# Altium schematic sheet MachineLearning-MM-Carrier.SchDoc: MachineLearning-MM-Carrier
size 459 x 320 mm; Origin: Eagle; Date: 5/7/2021 12:24:21 AM; SheetNumber: 1; DESIGNER: DESIGNER; REV: REV; GateName_1: G$1; SymbolName_1: FRAME_LEDGER; LibraryName: SparkFun-Aesthetics; DeviceSetName: FRAME-LEDGER; GateName_2: G$2; SymbolName_2: DOCFIELD; Sheet: Sheet:; ReleasedundertheCreativeCommons: Released under the Creative Commons; AttributionShare-Alike4.0License: Attribution Share-Alike 4.0 License; https://creativecommons.org/licenses/by-sa/4.0/: https://creativecommons.org/licenses/by-sa/4.0/; Designby: Design by:
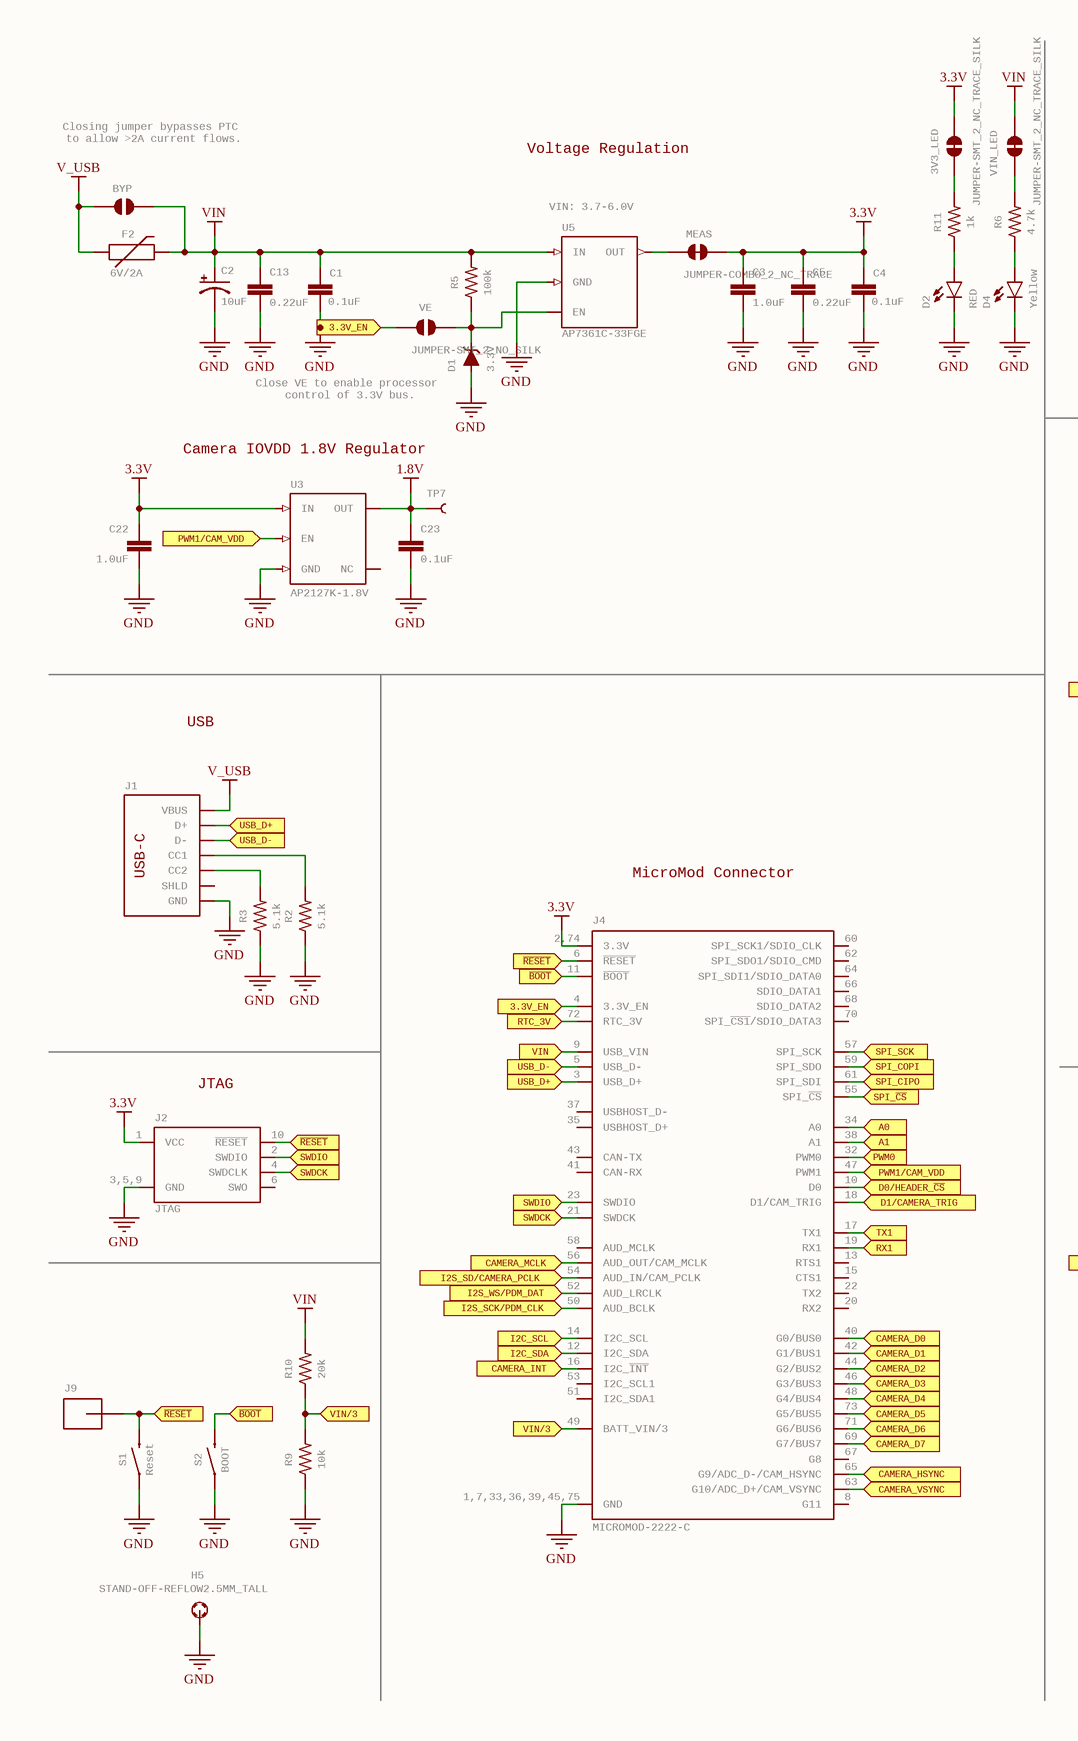
[diagram p0: MachineLearning-MM-Carrier.SchDoc, left]
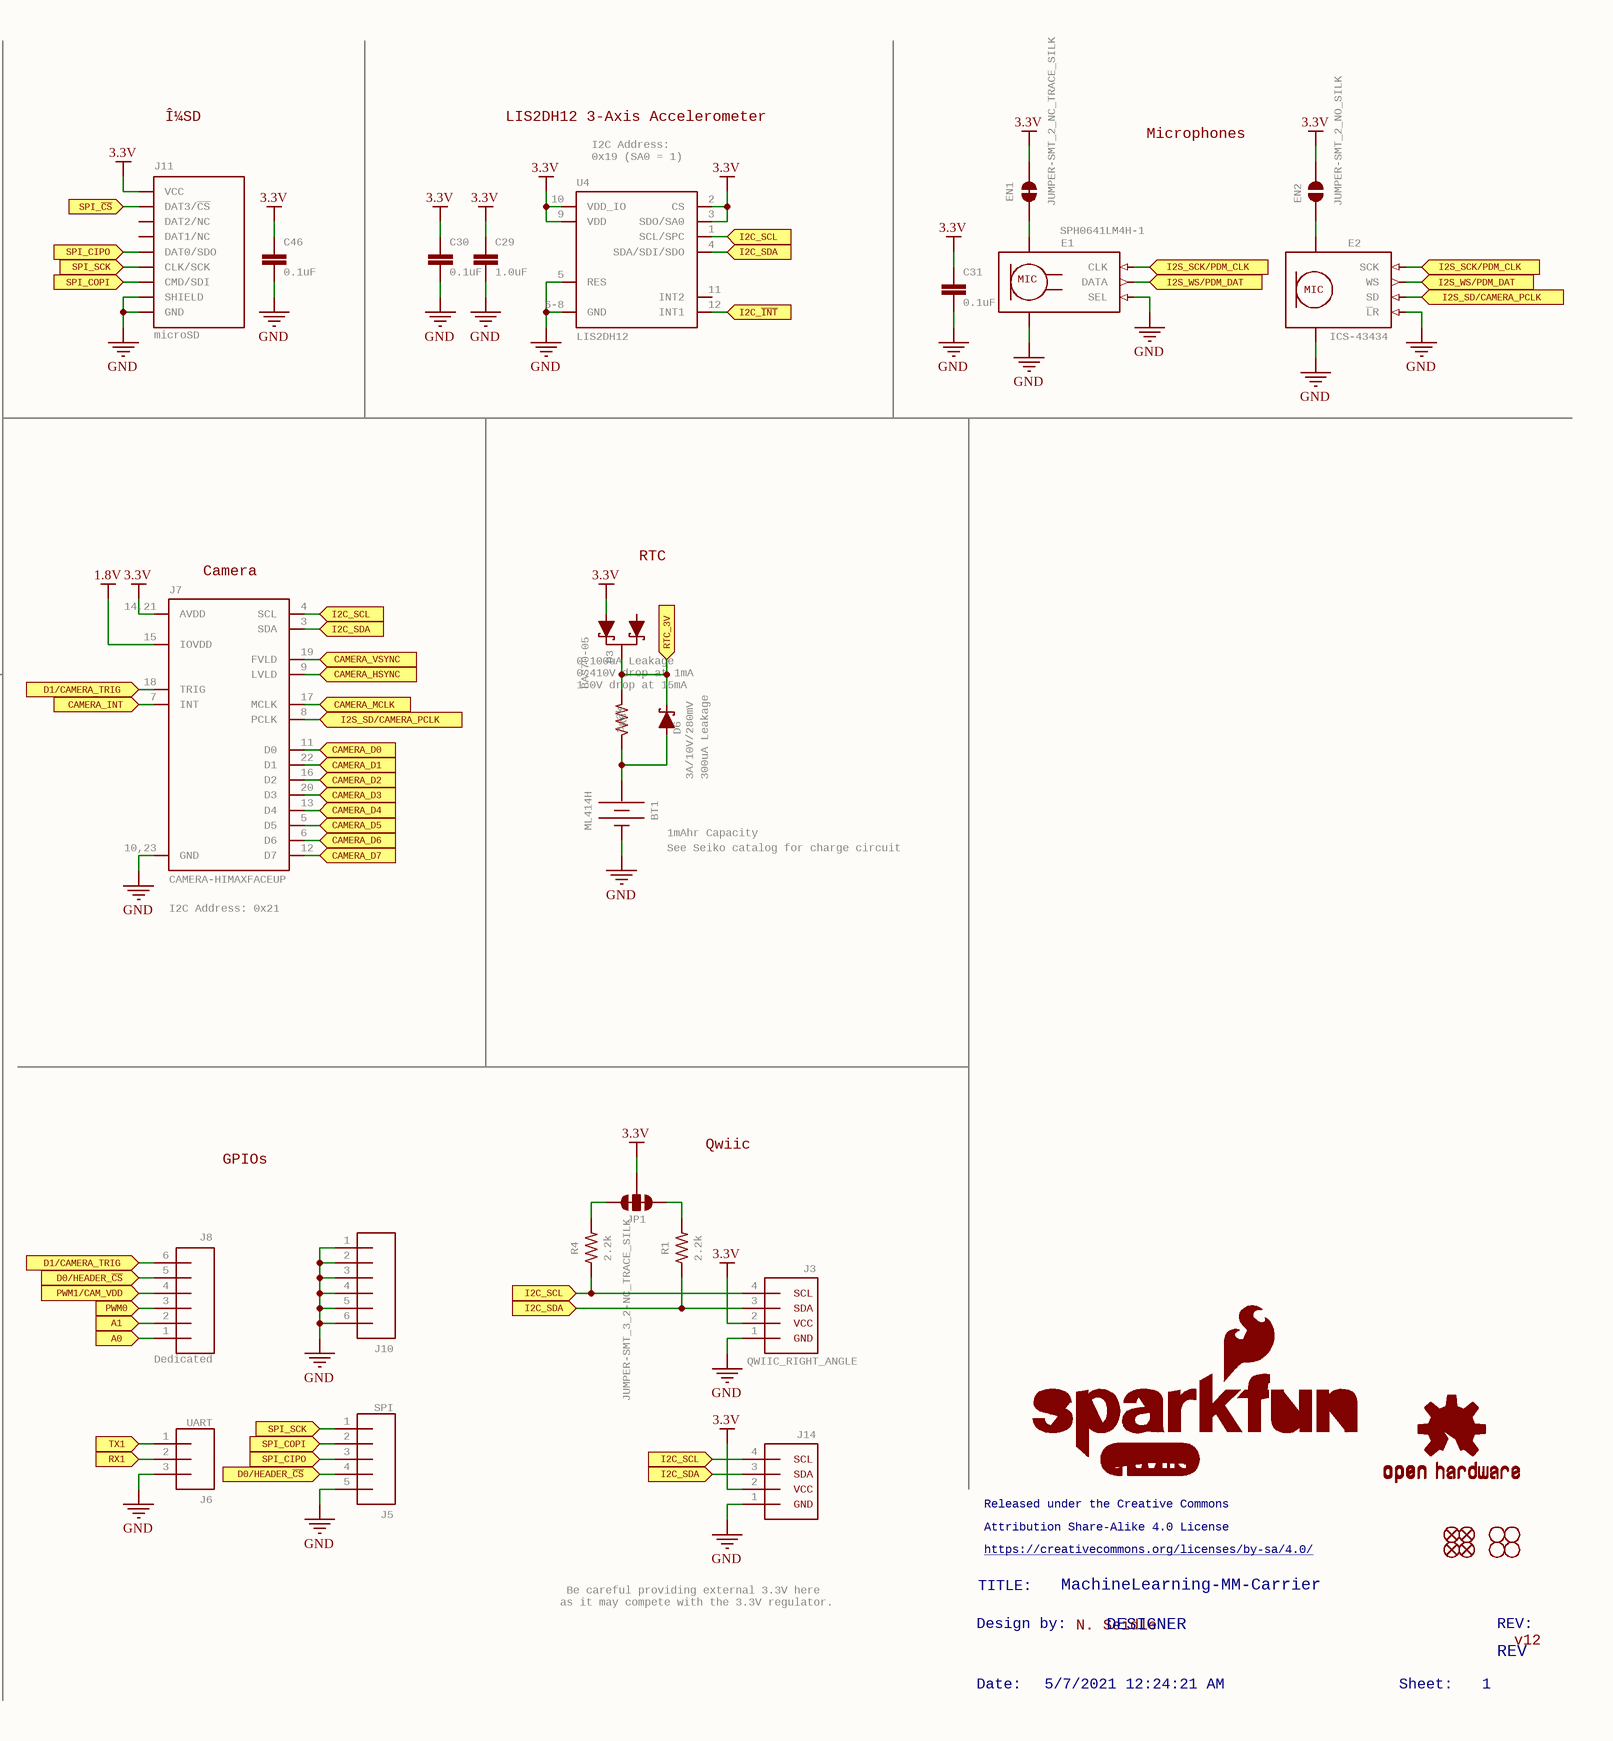
[diagram p1: MachineLearning-MM-Carrier.SchDoc, right]

## Parts
3V3_LED  JUMPER-SMT_2_NC_TRACE_SILK  [SMT-JUMPER_2_NC_TRACE_SILK]
BT1  ML414H  [ML414H_IV01E]
BYP  JUMPER-SMT_2_NO_SILK  [SMT-JUMPER_2_NO_SILK]  (value not drawn)
C1  0.1uF  [0603]
C2  10uF  [EIA3216]
C3  1.0uF  [0603]
C4  0.1uF  [0603]
C5  0.22uF  [0603]
C13  0.22uF  [0603]
C22  1.0uF  [0603]
C23  0.1uF  [0603]
C29  1.0uF  [0603]
C30  0.1uF  [0603]
C31  0.1uF  [0603]
C46  0.1uF  [0603]
D1  3.3V  [SOD-323]
D2  RED  [LED-0603]
D3  BAS70-05  [SOT23-3]
D4  Yellow  [LED-0603]
D6  3A/10V/280mV  [SOD-323]
E1  SPH0641LM4H-1  [SPH0641LM4H-1_MICROPHONE]
E2  ICS-43434  [ICS-43434]
EN1  JUMPER-SMT_2_NC_TRACE_SILK  [SMT-JUMPER_2_NC_TRACE_SILK]
EN2  JUMPER-SMT_2_NO_SILK  [SMT-JUMPER_2_NO_SILK]
F2  6V/2A  [1210]
FD1  FIDUCIALUFIDUCIAL  [FIDUCIAL-MICRO]  (value not drawn)
FD2  FIDUCIALUFIDUCIAL  [FIDUCIAL-MICRO]  (value not drawn)
FD3  FIDUCIALUFIDUCIAL  [FIDUCIAL-MICRO]  (value not drawn)
FD4  FIDUCIALUFIDUCIAL  [FIDUCIAL-MICRO]  (value not drawn)
H1  STAND-OFF  [STAND-OFF]  (value not drawn)
H2  STAND-OFF  [STAND-OFF]  (value not drawn)
H3  STAND-OFF  [STAND-OFF]  (value not drawn)
H4  STAND-OFF  [STAND-OFF]  (value not drawn)
H5  STAND-OFF-REFLOW2.5MM_TALL  [STAND-OFF-REFLOW-M2.5]
J1  USB_C_2-LAYER_PADS  [USB-C-16P-2LAYER-PADS]  (value not drawn)
J2  JTAG  [2X5-PTH-1.27MM]
J3  QWIIC_RIGHT_ANGLE  [JST04_1MM_RA]
J4  MICROMOD-2222-C  [M.2-CONNECTOR-E]
J5  SPI  [1X05_NO_SILK]
J6  UART  [1X03_NO_SILK]
J7  CAMERA-HIMAXFACEUP  [FPC05024-42201]
J8  Dedicated  [1X06_NO_SILK]
J9  CONN_01PTH_NO_SILK_YES_STOP  [1X01_NO_SILK]  (value not drawn)
J10  CONN_06NO_SILK_NO_POP  [1X06_NO_SILK]  (value not drawn)
J11  microSD  [MICRO-SD-SOCKET]
J14  I2C_STANDARD_NO_SILK  [1X04_NO_SILK]  (value not drawn)
JP1  JUMPER-SMT_3_2-NC_TRACE_SILK  [SMT-JUMPER_3_2-NC_TRACE_SILK]
LOGO1  SFE_LOGO_NAME_FLAME.1_INCH  [SFE_LOGO_NAME_FLAME_.1]  (value not drawn)
LOGO2  QWIIC_LOGO_CONNECTOR  [QWIIC_5.5MM]  (value not drawn)
LOGO3  OSHW-LOGOMINI  [OSHW-LOGO-MINI]  (value not drawn)
MEAS  JUMPER-COMBO_2_NC_TRACE  [COMBO-JUMPER_2_NC_TRACE]
R1  2.2k  [0603]
R2  5.1k  [0603]
R3  5.1k  [0603]
R4  2.2k  [0603]
R5  100k  [0603]
R6  4.7k  [0603]
R8  3.3k  [0603]
R9  10k  [0603]
R10  20k  [0603]
R11  1k  [0603]
S1  Reset  [TACTILE_SWITCH_SMD_5.2MM]
S2  BOOT  [TACTILE_SWITCH_SMD_5.2MM]
TP7  TEST-POINT3X5  [PAD.03X.05]  (value not drawn)
U3  AP2127K-1.8V  [SOT23-5]
U4  LIS2DH12  [LGA-12-LISDH12]
U5  AP7361C-33FGE  [UDFN-8]
VE  JUMPER-SMT_2_NO_SILK  [SMT-JUMPER_2_NO_SILK]
VIN_LED  JUMPER-SMT_2_NC_TRACE_SILK  [SMT-JUMPER_2_NC_TRACE_SILK]

## Ports
3.3V_EN (in), A0 (in), A1 (in), CAMERA_D0 (in), CAMERA_D1 (in), CAMERA_D2 (in), CAMERA_D3 (in), CAMERA_D4 (in), CAMERA_D5 (in), CAMERA_D6 (in), CAMERA_D7 (in), CAMERA_HSYNC (in), CAMERA_INT (in), CAMERA_MCLK (in), CAMERA_VSYNC (in), D0/HEADER_~{CS} (in), D1/CAMERA_TRIG (in), I2C_SCL (in), I2C_SDA (in), I2C_~{INT} (in), I2S_SCK/PDM_CLK (in), I2S_SD/CAMERA_PCLK (in), I2S_WS/PDM_DAT (in), PWM0 (in), PWM1/CAM_VDD (in), RTC_3V (in), RX1 (in), SPI_CIPO (in), SPI_COPI (in), SPI_SCK (in), SPI_~{CS} (in), SWDCK (in), SWDIO (in), TX1 (in), USB_D+ (in), USB_D- (in), VIN (in), VIN/3 (in), ~{BOOT} (in), ~{RESET} (in)

## Nets
1.8V: C23.1 J7.15(IOVDD) TP7.P$1 U3.5(OUT)
3.3V: 3V3_LED.2 C3.1 C4.1 C5.1 C22.1 C29.1 C30.1 C31.1 C46.1 D3.2(A1) EN1.2 EN2.2 J2.1(VCC) J3.2 J4.2,74(3.3V) J7.14,21(AVDD) J11.VCC J14.2 JP1.2 MEAS.2,4 U3.1(IN) U4.2(CS) U4.3(SDO/SA0) U4.9(VDD) U4.10(VDD_IO)
GND: BT1.- C1.2 C2.- C3.2 C4.2 C5.2 C13.2 C22.2 C23.2 C29.2 C30.2 C31.2 C46.2 D1.A D2.C D4.C E1.2(SEL) E1.3,6,7,8(GND) E2.2(~{L}R) E2.3,7,8,9(GND) H5.1 J1.GND,GND2(GND) J2.3,5,9(GND) J3.1 J4.1,7,33,36,39,45,75(GND) J5.5 J6.3 J7.10,23(GND) J10.1 J10.2 J10.3 J10.4 J10.5 J10.6 J11.CD1(SHIELD) J11.GND,GND1,GND3(GND) J14.1 R2.1 R3.1 R9.1 S1.1,2 S2.1,2 U3.2(GND) U4.5(RES) U4.6-8(GND) U5.4,EP(GND)
V_USB: BYP.1 F2.1 J1.VBUS1,2(VBUS)
VIN: BYP.2 C1.1 C2.+ C13.1 F2.2 R5.2 R10.2 U5.8(IN) VIN_LED.2
3.3V_EN: J4.4(3.3V_EN) VE.1 ; port 3.3V_EN
A0: J4.34(A0) J8.1 ; port A0
A1: J4.38(A1) J8.2 ; port A1
~{BOOT}: J4.11(~{BOOT}) S2.3,4 ; port ~{BOOT}
CAMERA_D0: J4.40(G0/BUS0) J7.11(D0) ; port CAMERA_D0
CAMERA_D1: J4.42(G1/BUS1) J7.22(D1) ; port CAMERA_D1
CAMERA_D2: J4.44(G2/BUS2) J7.16(D2) ; port CAMERA_D2
CAMERA_D3: J4.46(G3/BUS3) J7.20(D3) ; port CAMERA_D3
CAMERA_D4: J4.48(G4/BUS4) J7.13(D4) ; port CAMERA_D4
CAMERA_D5: J4.73(G5/BUS5) J7.5(D5) ; port CAMERA_D5
CAMERA_D6: J4.71(G6/BUS6) J7.6(D6) ; port CAMERA_D6
CAMERA_D7: J4.69(G7/BUS7) J7.12(D7) ; port CAMERA_D7
CAMERA_HSYNC: J4.65(G9/ADC_D-/CAM_HSYNC) J7.9(LVLD) ; port CAMERA_HSYNC
CAMERA_INT: J4.16(I2C_~{INT}) J7.7(INT) ; port CAMERA_INT
CAMERA_MCLK: J4.56(AUD_OUT/CAM_MCLK) J7.17(MCLK) ; port CAMERA_MCLK
CAMERA_VSYNC: J4.63(G10/ADC_D+/CAM_VSYNC) J7.19(FVLD) ; port CAMERA_VSYNC
D0/HEADER_~{CS}: J4.10(D0) J5.4 J8.5 ; port D0/HEADER_~{CS}
D1/CAMERA_TRIG: J4.18(D1/CAM_TRIG) J7.18(TRIG) J8.6 ; port D1/CAMERA_TRIG
I2C_~{INT}: U4.12(INT1) ; port I2C_~{INT}
I2C_SCL: J3.4 J4.14(I2C_SCL) J7.4(SCL) J14.4 R4.1 U4.1(SCL/SPC) ; port I2C_SCL
I2C_SDA: J3.3 J4.12(I2C_SDA) J7.3(SDA) J14.3 R1.1 U4.4(SDA/SDI/SDO) ; port I2C_SDA
I2S_SCK/PDM_CLK: E1.4(CLK) E2.4(SCK) J4.50(AUD_BCLK) ; port I2S_SCK/PDM_CLK
I2S_SD/CAMERA_PCLK: E2.6(SD) J4.54(AUD_IN/CAM_PCLK) J7.8(PCLK) ; port I2S_SD/CAMERA_PCLK
I2S_WS/PDM_DAT: E1.1(DATA) E2.1(WS) J4.52(AUD_LRCLK) ; port I2S_WS/PDM_DAT
PWM0: J4.32(PWM0) J8.3 ; port PWM0
PWM1/CAM_VDD: J4.47(PWM1) J8.4 U3.3(EN) ; port PWM1/CAM_VDD
~{RESET}: J2.10(~{RESET}) J4.6(~{RESET}) J9.1 S1.3,4 ; port ~{RESET}
RTC_3V: D3.3(C) D6.C J4.72(RTC_3V) R8.2 ; port RTC_3V
RX1: J4.19(RX1) J6.2 ; port RX1
SPI_~{CS}: J4.55(SPI_~{CS}) J11.CS/DAT3(DAT3/~{CS}) ; port SPI_~{CS}
SPI_CIPO: J4.61(SPI_SDI) J5.3 J11.DO/DAT0(DAT0/SDO) ; port SPI_CIPO
SPI_COPI: J4.59(SPI_SDO) J5.2 J11.DI/CMD(CMD/SDI) ; port SPI_COPI
SPI_SCK: J4.57(SPI_SCK) J5.1 J11.SCLK(CLK/SCK) ; port SPI_SCK
SWDCK: J2.4(SWDCLK) J4.21(SWDCK) ; port SWDCK
SWDIO: J2.2(SWDIO) J4.23(SWDIO) ; port SWDIO
TX1: J4.17(TX1) J6.1 ; port TX1
USB_D+: J1.A6,B6(D+) J4.3(USB_D+) ; port USB_D+
USB_D-: J1.A7,B7(D-) J4.5(USB_D-) ; port USB_D-
VIN: J4.9(USB_VIN) ; port VIN  [a separate net that carries the same name]
VIN/3: J4.49(BATT_VIN/3) R9.2 R10.1 ; port VIN/3
Net3V3_LED_1: 3V3_LED.1 R11.2
NetBT1_+: BT1.+ D6.A R8.1
NetD1_C: D1.C R5.1 U5.5(EN) VE.2
NetD2_A: D2.A R11.1
NetD4_A: D4.A R6.1
NetE1_5: E1.5(VDD) EN1.1
NetE2_5: E2.5(VDD) EN2.1
NetJ1_A5: J1.A5(CC1) R2.2
NetJ1_B5: J1.B5(CC2) R3.2
NetJP1_1: JP1.1 R1.2
NetJP1_3: JP1.3 R4.2
NetMEAS_1,3: MEAS.1,3 U5.1(OUT)
NetR6_2: R6.2 VIN_LED.1

Not connected (* = marked no-connect by the designer): D3 1(A); J1 SHLD1-4(SHLD); J2 6(SWO); J4 8(G11) 13(RTS1) 15(CTS1) 20(RX2) 22(TX2) 35(USBHOST_D+) 37(USBHOST_D-) 41(CAN-RX) 43(CAN-TX) 51(I2C_SDA1) 53(I2C_SCL1) 58(AUD_MCLK) 60(SPI_SCK1/SDIO_CLK) 62(SPI_SDO1/SDIO_CMD) 64(SPI_SDI1/SDIO_DATA0) 66(SDIO_DATA1) 67(G8) 68(SDIO_DATA2) 70(SPI_~{CS1}/SDIO_DATA3); J7 MNT1 MNT2; J11 DAT1(DAT1/NC) DAT2(DAT2/NC); U3 4(NC); U4 11(INT2)

## Notes on the sheet
- Closing jumper bypasses PTC
  to allow >2A current flows.
- Voltage Regulation
- Î¼SD
- (near U4) I2C Address:
  0x19 (SA0 = 1)
- LIS2DH12 3-Axis Accelerometer
- Microphones
- (near U5) VIN: 3.7-6.0V
- (near D1) Close VE to enable processor
  control of 3.3V bus.
- Camera IOVDD 1.8V Regulator
- (near J7) Camera
- (near D3) RTC
- (near D3) 0.100uA Leakage
  0.410V drop at 1mA
  1.0V drop at 15mA
- USB
- (near BT1) 1mAhr Capacity
- (near D6) 300uA Leakage
- MicroMod Connector
- (near J7) I2C Address: 0x21
- (near BT1) See Seiko catalog for charge circuit
- (near J2) JTAG
- Qwiic
- GPIOs
- Released under the Creative Commons
- TITLE:
- Attribution Share-Alike 4.0 License
- https://creativecommons.org/licenses/by-sa/4.0/
- MachineLearning-MM-Carrier
- Be careful providing external 3.3V here
  as it may compete with the 3.3V regulator.
- Design by:
- N. Seidle
- DESIGNER
- REV:
- REV
- v12
- Date:
- 5/7/2021 12:24:21 AM
- Sheet:
- 1

## Library data of the parts
3V3_LED EN1 VIN_LED = JUMPER-SMT_2_NC_TRACE_SILK: Normally closed trace jumper    This jumper has a trace between two pads so it's normally closed (NC). Use a razor knife to open the connection. For best results follow the IPC guidelines for cutting traces: Cutout at least 0.063 mm (0.005 in).  Remove all loose material to clean up the cut area.  Seal the cut with an approved epoxy.       Reapply solder to reclose the connection.; GateName_1: G$1; SymbolName_1: SMT-JUMPER_2_NC_TRACE; DeviceName: _SILK; LibraryName: SparkFun-Jumpers; DeviceSetName: JUMPER-SMT_2_NC_TRACE
BT1 = ML414H_IV01E_BATTERY: SEIKO ML414H-IV01E Reflowable Lithium Battery    ML414H is a rechargeable, coin type battery with features such as Pb-free reflowable (Peak temperature: 260 C) and high temperature heat resistance. Battery Characteristics:  3.1V max voltage  Voff is 2V  1mAH  3k series resistor with battery  72 hour charge time from 2.0-3.1V  2.3-2.8V initial charge; GateName_1: G$1; PROD_ID: BATT-14267; SymbolName_1: BATTERY; LibraryName: SparkFun-Batteries; DeviceSetName: ML414H_IV01E_BATTERY
BYP EN2 VE = JUMPER-SMT_2_NO_SILK: Normally open jumper    This jumper has two pads in close proximity to each other. Apply solder to close the connection.   Round pads are easier to solder for beginners, but are a lot larger.   SparkFun Product that uses the round pads:  SparkFun EL Sequencer; GateName_1: G$1; SymbolName_1: SMT-JUMPER_2_NO; DeviceName: _SILK; LibraryName: SparkFun-Jumpers; DeviceSetName: JUMPER-SMT_2_NO
C1 C4 C30 C31 C46 = 0.1UF-0603-25V-(+80/-20%): 0.1ÂµF ceramic capacitors    A capacitor is a passive two-terminal electrical component used to store electrical energy temporarily in an electric field.; GateName_1: G$1; SymbolName_1: CAP; PROD_ID: CAP-00810; DeviceName: -0603-25V-(+80/-20%); LibraryName: SparkFun-Capacitors; DeviceSetName: 0.1UF
C2 = 10UF-POLAR-EIA3216-16V-10%(TANT): 10.0ÂµF polarized capacitors    A capacitor is a passive two-terminal electrical component used to store electrical energy temporarily in an electric field.; GateName_1: G$1; SymbolName_1: CAP_POL; PROD_ID: CAP-00811; DeviceName: -EIA3216-16V-10%(TANT); LibraryName: SparkFun-Capacitors; DeviceSetName: 10UF-POLAR
C3 C22 C29 = 1.0UF-0603-16V-10%: 1ÂµF ceramic capacitors    A capacitor is a passive two-terminal electrical component used to store electrical energy temporarily in an electric field.; GateName_1: G$1; SymbolName_1: CAP; PROD_ID: CAP-00868; DeviceName: -0603-16V-10%; LibraryName: SparkFun-Capacitors; DeviceSetName: 1.0UF
C5 C13 = 0.22UF-0603-25V-10%: 0.22ÂµF ceramic capacitors    A capacitor is a passive two-terminal electrical component used to store electrical energy temporarily in an electric field.; GateName_1: G$1; SymbolName_1: CAP; PROD_ID: CAP-07822; DeviceName: -0603-25V-10%; LibraryName: SparkFun-Capacitors; DeviceSetName: 0.22UF
C23 = 0.1UF-0603-100V-10%: 0.1ÂµF ceramic capacitors    A capacitor is a passive two-terminal electrical component used to store electrical energy temporarily in an electric field.; GateName_1: G$1; SymbolName_1: CAP; PROD_ID: CAP-08390; DeviceName: -0603-100V-10%; LibraryName: SparkFun-Capacitors; DeviceSetName: 0.1UF
D1 = DIODE-ZENER-MM3Z3V3T1G: Zener Diode    A Zener diode allows current to flow from its anode to its cathode like a normal semiconductor diode, but it also permits current to flow in the reverse direction when its "Zener voltage" is reached. - WIkipedia; GateName_1: G$1; PROD_ID: DIO-11284; SymbolName_1: DIODE-ZENER; DeviceName: -MM3Z3V3T1G; LibraryName: SparkFun-DiscreteSemi; DeviceSetName: DIODE-ZENER
D2 = LED-RED0603: Red SMD LED    Used in manufacturing of most products at SparkFun   Packages: 0603 - SMD 0603 package [Product Link]  0603 SMART - SMD 0603 SMART package ( more efficient and expensive)[Product Link]   1206 - SMD1206  package [Product Link]    SparkFun Products: Pro Mini 328 -5V  RedBoard  IOIO-OTG; GateName_1: G$1; DeviceName: 0603; PROD_ID: DIO-00819; SymbolName_1: LED; LibraryName: SparkFun-LED; DeviceSetName: LED-RED
D3 = DIODE-SCHOTTKY-DUAL: Diodes Incorporated - BAS70-05 Dual Schottky Diode    Two Schottky Diodes in a single SOT-23 package. Low reverse current (100 nA) Vf:   Datasheet referenced for footprint; GateName_1: G$1; PROD_ID: DIO-14829; SymbolName_1: DIODE-SCHOTTKY-DUAL; LibraryName: SparkFun-DiscreteSemi; DeviceSetName: DIODE-SCHOTTKY-DUAL
D4 = LED-YELLOW0603: Yellow SMD LED Used in manufacturing several products at SparkFun.    Packages:  0603 -  SMD 0603  package  0603 -SMART - SMART SMD 0603  package (more efficient/more expensive) [Product Link]   LilyPad - SMD1206  package[Product Datasheet]       SparkFun Products: Blynk Board  IOIO-OTG  XBee Explorer Serial; GateName_1: G$1; DeviceName: 0603; PROD_ID: DIO-09003; SymbolName_1: LED; LibraryName: SparkFun-LED; DeviceSetName: LED-YELLOW
D6 = DIODE-SCHOTTKY-BAT60A: Schottky diode    A Schottky diode is a semiconductor diode which has a low forward voltage drop and a very fast switching action.; GateName_1: G$1; PROD_ID: DIO-14072; SymbolName_1: DIODE-SCHOTTKY; DeviceName: -BAT60A; LibraryName: SparkFun-DiscreteSemi; DeviceSetName: DIODE-SCHOTTKY
E1 = SPH0641LM4H-1_MICROPHONE: SPH0641LM4H-1 Microphone A miniature, high-performance, low power, bottom port silicon digital microphone with a single bit PDM output.; GateName_1: E1; PROD_ID: IC-14361; SymbolName_1: SPH0641LM4H-1_MICROPHONE; LibraryName: SparkFun-Sensors; DeviceSetName: SPH0641LM4H-1_MICROPHONE; MIC: MIC
E2 = ICS-43434: GateName_1: U1; SymbolName_1: ICS-43434_MICROPHONE; PROD_ID: COMP-14898; LibraryName: Teensy; DeviceSetName: ICS-43434; MIC: MIC
F2 = PPTC_6V2A: Resettable Fuse PPTC    Resettable Fuse. Really a sort of resistor with a polymeric positive temperature coefficient whose resistance increases dramatically with an increase in temperature. When heated by the power passing through the resistance rises causing the current to be limited, protecting the circuit. This is achieved by the transition of the polymer from a crystalline to an amorphous state where the conductive carbon separates breaking the conductive pathways found in the cool crystalline structure. When a PPTC cools back down it resumes conducting letting the circuit turn back on.   SparkFun Products:  SparkFun RedBoard - Programmed with Arduino  Pro Micro - 5V/16MHz  Arduino Pro 328 - 5V/16MHz  MP3 Trigger; GateName_1: F1; DeviceName: _6V2A; PROD_ID: RES-14313; SymbolName_1: PPTC; LibraryName: SparkFun-Fuses; DeviceSetName: PPTC
FD1-FD4 = FIDUCIALUFIDUCIAL: Fiducial Alignment Points    Point-of-reference for pick-and-place machines and other optical instruments.; GateName_1: G$1; SymbolName_1: FIDUCIAL; DeviceName: UFIDUCIAL; LibraryName: SparkFun-Aesthetics; DeviceSetName: FIDUCIAL
H1-H4 = STAND-OFF: Stand Off    Drill holes for mechanically mounting via screws, standoffs, etc.   Note: Use the keepout ring to avoid running the screw head into surrounding components.  Variant Overviews  STAND-OFF - Mechanical footprint for a #4 phillips button head screw.  STAND-OFF-TIGHT - Mechanical footprint for a #4 phillips button head screw,      Example SparkFun Products  Screw - Phillips Head (1/4", 4-40, 10 pack) (PRT-10453)  Screw - Phillips Head (1/2", 4-40, 10 pack) (PRT-10452)  Screw - Phillips Head (3/4", 4-40, 10 pack) (PRT-10451)  Screw - Phillips Head (1", 4-40, 10 pack) (PRT-10450); GateName_1: G$1; SymbolName_1: STAND-OFF; LibraryName: SparkFun-Hardware; DeviceSetName: STAND-OFF
H5 = STAND-OFF-REFLOW2.5MM_TALL: Stand Off Reflow Compatible    A metal standoff that can be placed and reflowed onto a PCB.; GateName_1: G$1; PROD_ID: HW-14899; SymbolName_1: STAND-OFF-REFLOW; DeviceName: 2.5MM_TALL; LibraryName: SparkFun-Hardware; DeviceSetName: STAND-OFF-REFLOW
J1 = USB_C_2-LAYER_PADS: USB Type C 16Pin Connector Super Speed pins not available on the 16-pin purely SMD connector so this part is best for USB 2.0 implementations. D1 and D2 are tied together enabling D+/- no matter which way the cable is plugged into the connector. The two channel configuration pins (CC1/2) are exposed. These are normally connected to ground via 5.1k resistors but can be reconfigured for high current/high power applications.; GateName_1: J1; SymbolName_1: USB-C-MINIMUM; DeviceSetName: USB_C; PROD_ID: CONN-14122; DeviceName: _2-LAYER_PADS; LibraryName: SparkFun-Connectors; USB-C: USB-C
J2 = CORTEX_JTAG_DEBUG_MINIMUM_PTH: Cortex Debug Connector - 10 pin    Supports JTAG debug, Serial Wire debug, and Serial Wire Viewer. PTH and SMD connector options available.    General Connector Information    Products: PTH Connector -via Digi-Key  SparkFun PSoc  SparkFun T; GateName_1: G$1; SymbolName_1: CORTEX_DEBUG_MINIMUM; DeviceName: _PTH; LibraryName: SparkFun-Connectors; DeviceSetName: CORTEX_JTAG_DEBUG_MINIMUM
J3 = QWIIC_CONNECTORJS-1MM: SparkFun I2C Standard Qwiic Connector An SMD 1mm pitch JST connector makes it easy and quick (get it? Qwiic?) to connect I2C devices to each other. The Qwiic system enables fast and solderless connection between popular platforms and various sensors and actuators.   We carry 200mm, 100mm, 50mm, and breadboard friendly Qwiic cables. We also offer 10 pcs strips the SMD connectors.; GateName_1: G$1; SymbolName_1: I2C_STANDARD; DeviceName: JS-1MM; PROD_ID: CONN-13694; LibraryName: SparkFun-Connectors; DeviceSetName: QWIIC_CONNECTOR; SDA: SDA; VCC: VCC; GND: GND; SCL: SCL
J4 = MICROMOD-2222-C: MicroMod Connector  Description: A card edge connector and mating PCB connector to allow various MicroMod Processor Boards to be coupled with various carrier boards of different capabilities. Based on the M.2 standard.; GateName_1: J1; PROD_ID: CONN-14877; SymbolName_1: MICROMOD; DeviceName: -2222-C; LibraryName: SparkFun-MicroMod; DeviceSetName: MICROMOD
J5 = CONN_05NO_SILK: Multi connection point. Often used as Generic Header-pin footprint for 0.1 inch spaced/style header connections    On any of the 0.1 inch spaced packages, you can populate with these:  Break Away Headers - Straight (PRT-00116)   Break Away Male Headers - Right Angle (PRT-00553)   Female Headers (PRT-00115)   Break Away Headers - Machine Pin (PRT-00117)   Break Away Female Headers - Swiss Machine Pin (PRT-00743)        For SCREWTERMINALS and SPRING TERMINALS visit here:  Screw Terimnals on SparkFun.com (5mm/3.5mm/2.54mm spacing)       This device is also useful as a general connection point to wire up your design to another part of your project. Our various solder wires solder well into these plated through hole pads.  Hook-Up Wire - Assortment (Stranded, 22 AWG) (PRT-11375)   Hook-Up Wire - Assortment (Solid Core, 22 AWG) (PRT-11367)   View the entire wire category on our website here          Special notes:     Molex polarized connector foot print use with SKU : PRT-08231 with associated crimp pins and housings. 1MM SMD Version SKU: PRT-10208; GateName_1: G$1; SymbolName_1: CONN_05; DeviceName: NO_SILK; LibraryName: SparkFun-Connectors; DeviceSetName: CONN_05
J6 = CONN_031X03_NO_SILK: Multi connection point. Often used as Generic Header-pin footprint for 0.1 inch spaced/style header connections    On any of the 0.1 inch spaced packages, you can populate with these:  Break Away Headers - Straight (PRT-00116)   Break Away Male Headers - Right Angle (PRT-00553)   Female Headers (PRT-00115)   Break Away Headers - Machine Pin (PRT-00117)   Break Away Female Headers - Swiss Machine Pin (PRT-00743)   Stackable Header - 3 Pin (Female, 0.1") (PRT-13875)        For SCREWTERMINALS and SPRING TERMINALS visit here:  Screw Terimnals on SparkFun.com (5mm/3.5mm/2.54mm spacing)       This device is also useful as a general connection point to wire up your design to another part of your project. Our various solder wires solder well into these plated through hole pads.  Hook-Up Wire - Assortment (Stranded, 22 AWG) (PRT-11375)   Hook-Up Wire - Assortment (Solid Core, 22 AWG) (PRT-11367)   View the entire wire category on our website here          Special notes:         Molex polarized connector foot print use with SKU : PRT-08232 with associated crimp pins and housings.; GateName_1: J$1; SymbolName_1: CONN_03; DeviceName: 1X03_NO_SILK; LibraryName: SparkFun-Connectors; DeviceSetName: CONN_03
J7 = CAMERA-HIMAXFACEUP: GateName_1: G$1; SymbolName_1: CAMERA-OV7670-MODULE; DeviceName: FACEUP; LibraryName: SparkFun-Connectors; DeviceSetName: CAMERA-HIMAX
J8 J10 = CONN_06NO_SILK_NO_POP: Multi connection point. Often used as Generic Header-pin footprint for 0.1 inch spaced/style header connections    On any of the 0.1 inch spaced packages, you can populate with these:  Break Away Headers - Straight (PRT-00116)   Break Away Male Headers - Right Angle (PRT-00553)   Female Headers (PRT-00115)   Break Away Headers - Machine Pin (PRT-00117)   Break Away Female Headers - Swiss Machine Pin (PRT-00743)   Arduino Stackable Header - 6 Pin (PRT-09280)        For SCREWTERMINALS and SPRING TERMINALS visit here:  Screw Terimnals on SparkFun.com (5mm/3.5mm/2.54mm spacing)       This device is also useful as a general connection point to wire up your design to another part of your project. Our various solder wires solder well into these plated through hole pads.  Hook-Up Wire - Assortment (Stranded, 22 AWG) (PRT-11375)   Hook-Up Wire - Assortment (Solid Core, 22 AWG) (PRT-11367)   View the entire wire category on our website here; GateName_1: G$1; SymbolName_1: CONN_06; DeviceName: NO_SILK_NO_POP; LibraryName: SparkFun-Connectors; DeviceSetName: CONN_06
J9 = CONN_01PTH_NO_SILK_YES_STOP: Single connection point. Often used as Generic Header-pin footprint for 0.1 inch spaced/style header connections       On any of the 0.1 inch spaced packages, you can populate with these:   Break Away Headers - Straight (PRT-00116)   Break Away Male Headers - Right Angle (PRT-00553)   Female Headers (PRT-00115)   Break Away Headers - Machine Pin (PRT-00117)   Break Away Female Headers - Swiss Machine Pin (PRT-00743)          This device is also useful as a general connection point to wire up your design to another part of your project. Our various solder wires solder well into these plated through hole pads.   Hook-Up Wire - Assortment (Stranded, 22 AWG) (PRT-11375)   Hook-Up Wire - Assortment (Solid Core, 22 AWG) (PRT-11367)   View the entire wire category on our website here          Special notes:    SMTSO-256-ET is a "flush mount" nut for a 4-40 screw. We mostly use this on specialty testbeds; it is a nice way to connect hardware to your PCB at an adjustable hieght.    Also note, the SNAP packages are for using a snappable style connector. We sell a baggie of snaps and they are also used on two LilyPad designs:   Snap Assortment - 30 pack (male and female) (DEV-11347)  LilyPad Arduino SimpleSnap (DEV-10941)   LilyPad SimpleSnap Protoboard (DEV-10940); GateName_1: G$1; SymbolName_1: CONN_01; DeviceName: PTH_NO_SILK_YES_STOP; LibraryName: SparkFun-Connectors; DeviceSetName: CONN_01
J11 = MICRO-SD-SDIOPUSH-PUSH: microSD Socket for Transflash    Push-push type ÂµSD socket.  tDoc lines correctly indicate media card edge positions when inserting (unlocked, locked, depressed).   NOTE: CD1 and CD2 are connected internally, and the default detect state of the socket is detect pin to ground.   SparkFun Products: WAV Trigger  CAN-Bus Shield  SparkFun Level Shifing microSD Breakout; GateName_1: G$1; SymbolName_1: MICROSD-SDIO; PROD_ID: CONN-07820; DeviceName: PUSH-PUSH; LibraryName: SparkFun-Connectors; DeviceSetName: MICRO-SD-SDIO
J14 = I2C_STANDARD_NO_SILK: SparkFun I2C Standard Pinout Header    SparkFun has standardized on a pinout for all I2C based sensor breakouts.  This pinout allows I2C boards to be plugged directly into the headers on Arduino Uno compatible boards, and to be daisy chained easily.   Example SparkFun Products: SparkFun Atmospheric Sensor Breakout - BME280  SparkFun Altitude/Pressure Sensor Breakout - MPL3115A2  SparkFun TOF Range Finder Sensor - VL6180; GateName_1: G$1; SymbolName_1: I2C_STANDARD; DeviceName: _NO_SILK; LibraryName: SparkFun-Connectors; DeviceSetName: I2C_STANDARD; SDA: SDA; VCC: VCC; GND: GND; SCL: SCL
JP1 = JUMPER-SMT_3_2-NC_TRACE_SILK: Normally closed trace jumper (2 of 2 connections)    This jumper has a trace between all three pads so they are normally closed (NC). Use a razor knife to open the connection(s). For best results follow the IPC guidelines for cutting traces: Cutout at least 0.063 mm (0.005 in).  Remove all loose material to clean up the cut area.  Seal the cut with an approved epoxy.       Reapply solder to reclose the connection(s).; GateName_1: G$1; SymbolName_1: SMT-JUMPER_3_2-NC_TRACE; DeviceName: _SILK; LibraryName: SparkFun-Jumpers; DeviceSetName: JUMPER-SMT_3_2-NC_TRACE
LOGO1 = SFE_LOGO_NAME_FLAME.1_INCH: SparkFun Font Logo w/ Flame    This is the SparkFun full logo. The logo on the schematic will always be the same size; the package variant is the height of the flame part of the logo. Default layer for the logo on the board is tSilk.; GateName_1: G$1; SymbolName_1: SFE_LOGO_NAME_FLAME; DeviceName: .1_INCH; LibraryName: SparkFun-Aesthetics; DeviceSetName: SFE_LOGO_NAME_FLAME
LOGO2 = QWIIC_LOGO_CONNECTOR: Qwiic Logos for placement on schematic and PCB. The 5.5mm silk logo is best for placing next to Qwiic connector.; GateName_1: G$1; SymbolName_1: LOGO; DeviceName: _CONNECTOR; LibraryName: SparkFun-Aesthetics; DeviceSetName: QWIIC_LOGO
LOGO3 = OSHW-LOGOMINI: Open-Source Hardware (OSHW) Logo     This logo indicates the piece of hardware it is found on incorporates a OSHW license and/or adheres to the definition of open source hardware found here: http://freedomdefined.org/OSHW; GateName_1: G$1; DeviceName: MINI; SymbolName_1: OSHW-LOGO; LibraryName: SparkFun-Aesthetics; DeviceSetName: OSHW-LOGO
MEAS = JUMPER-COMBO_2_NC_TRACE: GateName_1: JP1; SymbolName_1: SMT-JUMPER_2_NC_TRACE-1; LibraryName: SparkFun-Jumpers; DeviceSetName: JUMPER-COMBO_2_NC_TRACE
R1 R4 = 2.2KOHM-0603-1/10W-1%: 2.2kÎ© resistor    A resistor is a passive two-terminal electrical component that implements electrical resistance as a circuit element. Resistors act to reduce current flow, and, at the same time, act to lower voltage levels within circuits. - Wikipedia; GateName_1: G$1; PROD_ID: RES-08272; SymbolName_1: RESISTOR; DeviceName: -0603-1/10W-1%; LibraryName: SparkFun-Resistors; DeviceSetName: 2.2KOHM
R2 R3 = 5.1KOHM5.1KOHM-0603-1/10W-1%: GateName_1: R1; SymbolName_1: RESISTOR; PROD_ID: RES-12083; DeviceName: 5.1KOHM-0603-1/10W-1%; LibraryName: SparkFun-Resistors; DeviceSetName: 5.1KOHM
R5 = 100KOHM-0603-1/10W-1%: 100kÎ© resistor    A resistor is a passive two-terminal electrical component that implements electrical resistance as a circuit element. Resistors act to reduce current flow, and, at the same time, act to lower voltage levels within circuits. - Wikipedia; GateName_1: G$1; PROD_ID: RES-07828; SymbolName_1: RESISTOR; DeviceName: -0603-1/10W-1%; LibraryName: SparkFun-Resistors; DeviceSetName: 100KOHM
R6 = 4.7KOHM-0603-1/10W-1%: 4.7kÎ© resistor    A resistor is a passive two-terminal electrical component that implements electrical resistance as a circuit element. Resistors act to reduce current flow, and, at the same time, act to lower voltage levels within circuits. - Wikipedia; GateName_1: G$1; PROD_ID: RES-07857; SymbolName_1: RESISTOR; DeviceName: -0603-1/10W-1%; LibraryName: SparkFun-Resistors; DeviceSetName: 4.7KOHM
R8 = 3.3KOHM-0603-1/10W-1%: 3.3kÎ© resistor    A resistor is a passive two-terminal electrical component that implements electrical resistance as a circuit element. Resistors act to reduce current flow, and, at the same time, act to lower voltage levels within circuits. - Wikipedia; GateName_1: G$1; PROD_ID: RES-07851; SymbolName_1: RESISTOR; DeviceName: -0603-1/10W-1%; LibraryName: SparkFun-Resistors; DeviceSetName: 3.3KOHM
R9 = 10KOHM-0603-1/10W-1%: 10kÎ© resistor    A resistor is a passive two-terminal electrical component that implements electrical resistance as a circuit element. Resistors act to reduce current flow, and, at the same time, act to lower voltage levels within circuits. - Wikipedia; GateName_1: G$1; DeviceSetName: 10KOHM; PROD_ID: RES-00824; SymbolName_1: RESISTOR; DeviceName: -0603-1/10W-1%; LibraryName: SparkFun-Resistors
R10 = 20KOHM-0603-1/10W-1%: 20kÎ© resistor    A resistor is a passive two-terminal electrical component that implements electrical resistance as a circuit element. Resistors act to reduce current flow, and, at the same time, act to lower voltage levels within circuits. - Wikipedia; GateName_1: G$1; DeviceSetName: 20KOHM; PROD_ID: RES-09383; SymbolName_1: RESISTOR; DeviceName: -0603-1/10W-1%; LibraryName: SparkFun-Resistors
R11 = 1KOHM-0603-1/10W-1%: 1kÎ© resistor    A resistor is a passive two-terminal electrical component that implements electrical resistance as a circuit element. Resistors act to reduce current flow, and, at the same time, act to lower voltage levels within circuits. - Wikipedia; GateName_1: G$1; DeviceSetName: 1KOHM; PROD_ID: RES-07856; SymbolName_1: RESISTOR; DeviceName: -0603-1/10W-1%; LibraryName: SparkFun-Resistors
S1 S2 = MOMENTARY-SWITCH-SPST-SMD-5.2-TALL-REDUNDANT: Momentary Switch (Pushbutton) - SPST    Normally-open (NO) SPST momentary switches (buttons, pushbuttons). Variants  PTH-12MM - 12mm square, through-hole  Momentary Pushbutton Switch - 12mm Square (COM-09190)     PTH-6.0MM, PTH-6.0MM-KIT - 6.0mm square, through-hole  Mini Pushbutton Switch (COM-00097)  KIT package intended for soldering kit's - only one side of pads' copper is exposed.     PTH-RIGHT-ANGLE-KIT - Right-angle, through-hole  Right Angle Tactile Button - Used on SparkFun BigTime Watch Kit     SMD-12MM - 12mm square, surface-mount  Tactile Button - SMD (12mm) (COM-12993)  Used on SparkFun PicoBoard     SMD-4.5MM - 4.5mm Square Trackball Switch  Used on SparkFun Blackberry Trackballer Breakout     SMD-4.6MMX2.8MM -  4.60mm x 2.80mm, surface mount  Used on SparkFun SAMD21 Mini Breakout     SMD-5.2MM, SMD-5.2-REDUNDANT - 5.2mm square, surface-mount  Mini Pushbutton Switch - SMD (COM-08720)  Used on Arduino Pro Mini  REDUNDANT package connects both switch circuits together     SMD-6.0X3.5MM - 6.0 x 3.5mm, surface mount  Momentary Reset Switch SMD (COM-08229)     SMD-6.2MM-TALL - 6.2mm square, surface mount  Tactile Button - SMD (6mm)  Used on SparkFun Digital Sandbox     SMD-RIGHT-ANGLE - Right-angle, surface mount  Used on SparkFun Block for IntelÂ® Edison - Arduino; GateName_1: G$1; SymbolName_1: SWITCH-MOMENTARY-2; PROD_ID: SWCH-14139; DeviceName: -SMD-5.2-TALL-REDUNDANT; LibraryName: SparkFun-Switches; DeviceSetName: MOMENTARY-SWITCH-SPST
TP7 = TEST-POINT3X5: SparkFun Test Points    Bare copper test points for troubleshooting or In-Circuit-Testing. These are used by our Production team for verifying production board runs using pogo-pins on test beds.   SparkFun Products: SparkFun LSM9DS1 Breakout  SparkFun PSOC  SparkFun Load Cell Amplifier; GateName_1: G$1; DeviceName: 3X5; SymbolName_1: TEST-POINT; LibraryName: SparkFun-Connectors; DeviceSetName: TEST-POINT
U3 = V_REG_AP2127K-1.8V: AP2127 - 300mA CMOS LDO Regulator w/ Enable    The AP2127 is CMOS process low dropout linear regulator with enable function, the regulator delivers a guaranteed 300mA (min.) continuous load current.   Features  Output Voltage Accuracy: Â±1.5%   Output Current: 300mA (Min.)   Foldback Short Current Protection: 50mA   Enable Function to Turn ON/OFF VOUT  Low Dropout Voltage (3.3V): 250mV (Typ.) @IOUT=600mA   Excellent Load Regulation: 0.2%/A (Typ.)   Excellent Line Regulation: 0.02%/V (Typ.)   Low Quiescent Current: 55Î¼A (Typ.)  Low Standby Current: 0.01Î¼A (Typ.)  Low Output Noise: 50Î¼VRMS   PSRR: 100Hz -65dB, 1kHz -65dB    OTSD Protection   Stable  with  1.0Î¼F Flexible Cap: Ceramic, Tantalum and Aluminum Electrolytic   Operation Temperature Range: -40Â°C to 85Â°C   ESD: MM 400V, HBM 4000V; GateName_1: G$1; SymbolName_1: V-REG-LDO_NO-BP; DeviceName: K-1.8V; PROD_ID: VREG-14239; LibraryName: SparkFun-IC-Power; DeviceSetName: V_REG_AP2127
U4 = LIS2DH12: GateName_1: G$1; PROD_ID: IC-14229; SymbolName_1: LIS2DH12; LibraryName: SparkFun-Sensors; DeviceSetName: LIS2DH12; DIGIKEY: 497-14851-2-ND
U5 = AP7361C-33FGEUDFN-8: AP7361C 3.3V LDO Regulator; GateName_1: G$1; PROD_ID: VREG-14094; SymbolName_1: AP7361C; DeviceName: UDFN-8; LibraryName: SparkFun-IC-Power; DeviceSetName: AP7361C-33FGE